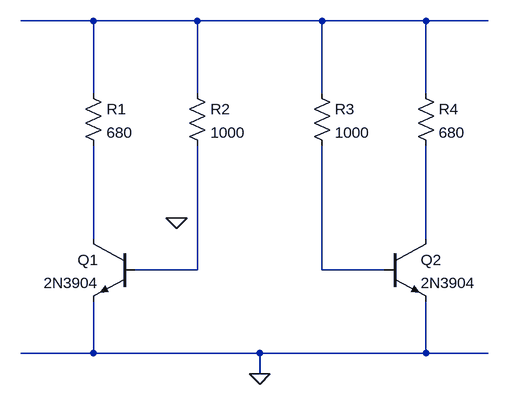
[diagram p0: schematic 1.asc]
1.asc, the LTspice schematic file:
Version 4
SHEET 1 880 680
WIRE -128 -304 -240 -304
WIRE 32 -304 -128 -304
WIRE 224 -304 32 -304
WIRE 384 -304 224 -304
WIRE 480 -304 384 -304
WIRE -128 -192 -128 -304
WIRE 32 -192 32 -304
WIRE 224 -192 224 -304
WIRE 384 -192 384 -304
WIRE -128 32 -128 -112
WIRE 384 32 384 -112
WIRE 32 80 32 -112
WIRE 32 80 -64 80
WIRE 224 80 224 -112
WIRE 320 80 224 80
WIRE -128 208 -128 128
WIRE -128 208 -240 208
WIRE 128 208 -128 208
WIRE 384 208 384 128
WIRE 384 208 128 208
WIRE 480 208 384 208
WIRE 128 240 128 208
FLAG 128 240 0
FLAG 0 0 0
SYMBOL npn -64 32 M0
SYMATTR InstName Q1
SYMATTR Value 2N3904
SYMBOL npn 320 32 R0
SYMATTR InstName Q2
SYMATTR Value 2N3904
SYMBOL res -144 -208 R0
SYMATTR InstName R1
SYMATTR Value 680
SYMATTR SpiceLine tol=5 pwr=0.25
SYMBOL res 16 -208 R0
SYMATTR InstName R2
SYMATTR Value 1000
SYMATTR SpiceLine tol=5 pwr=0.25
SYMBOL res 208 -208 R0
SYMATTR InstName R3
SYMATTR Value 1000
SYMATTR SpiceLine tol=5 pwr=0.25
SYMBOL res 368 -208 R0
SYMATTR InstName R4
SYMATTR Value 680
SYMATTR SpiceLine tol=5 pwr=0.25

The netlist it stands for:
* 1.asc
Q1 N002 N004 0 0 2N3904
Q2 N003 N005 0 0 2N3904
R1 N001 N002 680 tol=5 pwr=0.25
R2 N001 N004 1000 tol=5 pwr=0.25
R3 N001 N005 1000 tol=5 pwr=0.25
R4 N001 N003 680 tol=5 pwr=0.25
.model NPN NPN
.model PNP PNP
.lib standard.bjt
.backanno
.end